# EAGLE schematic Modulo_versão_10 (EAGLE 6.4)
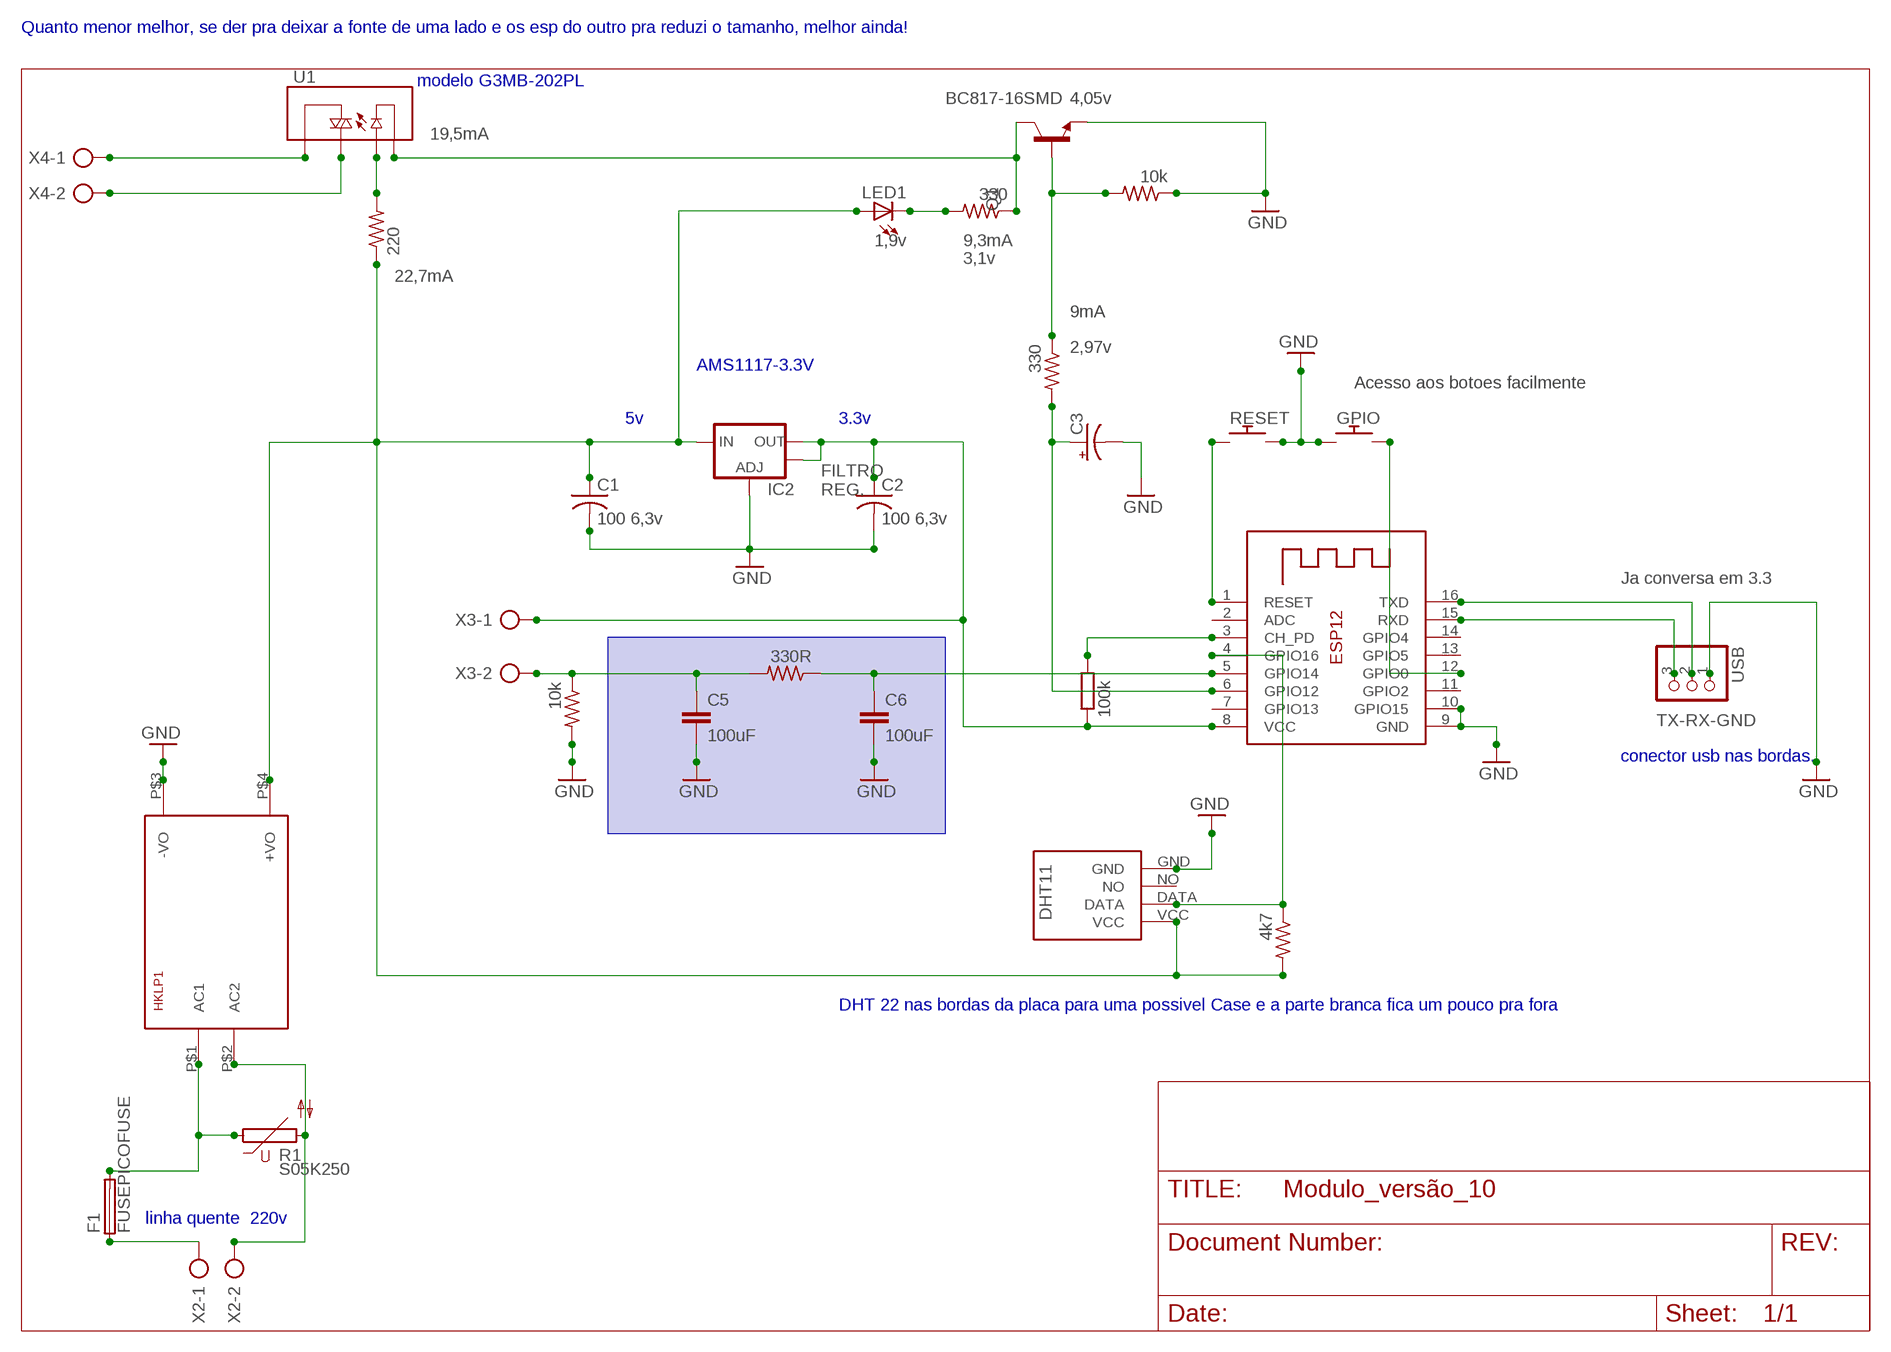
[diagram p0: schematic, sheet 1]

## Parts
1  10k  R-US_M0805  [M0805]
2  10k  R-US_M0805  [M0805]
3  100k  R-EU_M0805  [M0805]
4  330R  R-US_M0805  [M0805]
5  330  R-US_M0805  [M0805]
6  220  R-US_M0805  [M0805]
7  330  R-US_M0805  [M0805]
8  4k7  R-US_M0805  [M0805]
C1  100 6,3v  C-USC0805  [C0805]
C2  100 6,3v  C-USC0805  [C0805]
C3  CPOL-US153CLV-0605  [153CLV-0605]
C5  100uF  C-EUC0805  [C0805]
C6  100uF  C-EUC0805  [C0805]
F1  FUSEPICOFUSE  [PICOFUSE]
GPIO  GPIO  SWITCH_PUSHBUTTONEVQ-PE  [TACT_PANA-EVQ]
HKLP1  HKLPM01  [HKLPM01]
IC2  V_REG_LM1117SOT223  [SOT223]
LED1  LEDCHIPLED_0805  [CHIPLED_0805]
Q1  BC817-16SMD  [SOT23-BEC]
R1  S05K250  [S05K250]
RESET  RESET  SWITCH_PUSHBUTTONEVQ-PE  [TACT_PANA-EVQ]
U1  RELAY-SOLIDSTATEPTH  [RELAY-S108T02]
U$1  DHT11-PION.  [DHT11-PION.]
USB  PINHD-1X3  [1X03]
X2  AK500/2  [AK500/2]
X3  AK500/2  [AK500/2]
X4  AK500/2  [AK500/2]
X5  ESP-12  [ESP-12]

## Nets
2N3904: 5.1 Q1.C U1.4(-)
5V: 6.1 8.2 C1.1 HKLP1.P$4(+VO) IC2.3(IN) LED1.A U$1.VCC
GND: 1.1 2.2 C1.2 C2.2 C3.- C5.2 C6.2 GPIO.P$1 HKLP1.P$3(-VO) IC2.1(ADJ) Q1.E RESET.P$2 U$1.GND USB.1 X5.9(GND) X5.10(GPIO15)
N$2: 3.1 C2.1 IC2.2(OUT) IC2.4(OUT) X3.1 X5.8(VCC)
N$3: 5.2 LED1.C
N$9: U1.2(T2) X4.2
N$11: U1.1(T1) X4.1
N$12: USB.3 X5.15(RXD)
N$15: RESET.P$1 X5.1(RESET)
N$16: F1.1 X2.1
N$17: 1.2 7.1 Q1.B
N$19: F1.2 HKLP1.P$1(AC1) R1.1
N$20: 4.1 C6.1 X5.5(GPIO14)
N$21: 6.2 U1.3(+)
N$23: 2.1 4.2 C5.1 X3.2
N$24: 3.2 X5.3(CH_PD)
N$25: 7.2 C3.+ X5.6(GPIO12)
N$35: HKLP1.P$2(AC2) R1.2 X2.2
N$41: 8.1 U$1.DATA X5.4(GPIO16)
N$45: GPIO.P$2 X5.12(GPIO0)
N$48: USB.2 X5.16(TXD)
Unconnected: U$1.NO X5.2(ADC) X5.7(GPIO13) X5.11(GPIO2) X5.13(GPIO5) X5.14(GPIO4)

## Notes on the sheet
- Quanto menor melhor, se der pra deixar a fonte de uma lado e os esp do outro pra reduzi o tamanho, melhor ainda!
- modelo G3MB-202PL
- 4,05v
- 19,5mA
- 1,9v | 9,3mA
- 3,1v
- 22,7mA
- 9mA
- 2,97v
- AMS1117-3.3V
- Acesso aos botoes facilmente
- 5v | 3.3v
- FILTRO
  REG.
- Ja conversa em 3.3
- TX-RX-GND
- conector usb nas bordas.
- DHT 22 nas bordas da placa para uma possivel Case e a parte branca fica um pouco pra fora
- linha quente  220v

## Library data of the parts
1 2 4-8 = adafruit:R-US_: RESISTOR, American symbol
3 = rcl:R-EU_: RESISTOR, European symbol
C1 C2 = adafruit:C-US: CAPACITOR, American symbol
C3 = rcl:CPOL-US: POLARIZED CAPACITOR, American symbol
C5 C6 = rcl:C-EU: CAPACITOR, European symbol
F1 = fuse:FUSE: Fuse; OC_FARNELL: unknown; OC_NEWARK: unknown
GPIO RESET = adafruit:SWITCH_PUSHBUTTON: Buttons SOFTTOUCHSMD_SJ - Soft touch temporary push button (Super Junk Akihabara) Compatible with SKPMANE010 [Mouser: 688-SKPMAN] C&K_KSS = Digikey: KSS221GLFS
HKLP1 = HKLPM01:HKLPM01
IC2 = SparkFun-PowerIC:V_REG_LM1117: Voltage Regulator LM1117 Standard adjustable voltage regulator but in SMD form. Spark Fun Electronics SKU : COM-00595
LED1 = adafruit:LED: LED OSRAM: - CHIPLED LG R971, LG N971, LY N971, LG Q971, LY Q971, LO R971, LY R971 LH N974, LH R974 LS Q976, LO Q976, LY Q976 LO Q996 - Hyper CHIPLED LW Q18S LB Q993, LB Q99A, LB R99A - SideLED LS A670, LO A670, LY A670, LG A670, LP A670 LB A673, LV A673, LT A673, LW A673 LH A674 LY A675 LS A676, LA A676, LO A676, LY A676, LW A676 LS A679, LY A679, LG A679 - Hyper Micro SIDELED® LS Y876, LA Y876, LO Y876, LY Y876 LT Y87S - SmartLED LW L88C, LW L88S LB L89C, LB L89S, LG L890 LS L89K, LO L89K, LY L89K LS L896, LA L896, LO L896, LY L896 - TOPLED LS T670, LO T670, LY T670, LG T670, LP T670 LSG T670, LSP T670, LSY T670, LOP T670, LYG T670 LG T671, LOG T671, LSG T671 LB T673, LV T673, LT T673, LW T673 LH T674 LS T676, LA T676, LO T676, LY T676, LB T676, LH T676, LSB T676, LW T676 LB T67C, LV T67C, LT T67C, LS T67K, LO T67K, LY T67K, LW E67C LS E67B, LA E67B, LO E67B, LY E67B, LB E67C, LV E67C, LT E67C LW T67C LS T679, LY T679, LG T679 LS T770, LO T770, LY T770, LG T770, LP T770 LB T773, LV T773, LT T773, LW T773 LH T774 LS E675, LA E675, LY E675, LS T675 LS T776, LA T776, LO T776, LY T776, LB T776 LHGB T686 LT T68C, LB T68C - Hyper Mini TOPLED® LB M676 - Mini TOPLED Santana® LG M470 LS M47K, LO M47K, LY M47K Source: http://www.osram.convergy.de/
Q1 = transistor-npn:BC817*: NPN Transistor
R1 = varistor:S05K250: VARISTOR
U1 = SparkFun-Electromechanical:RELAY-SOLIDSTATE: SPST SS relay
U$1 = DHT11:DHT11-PION.: DHT11 Czujnik temperatury i wilgotności (widok pionowy)
USB = adafruit:PINHD-1X3: PIN HEADER
X2-X4 = con-ptr500:AK500/2: CONNECTOR; OC_FARNELL: unknown; OC_NEWARK: unknown
X5 = adafruit:ESP-12